# EAGLE design 453_mic (EAGLE 9.6.2)
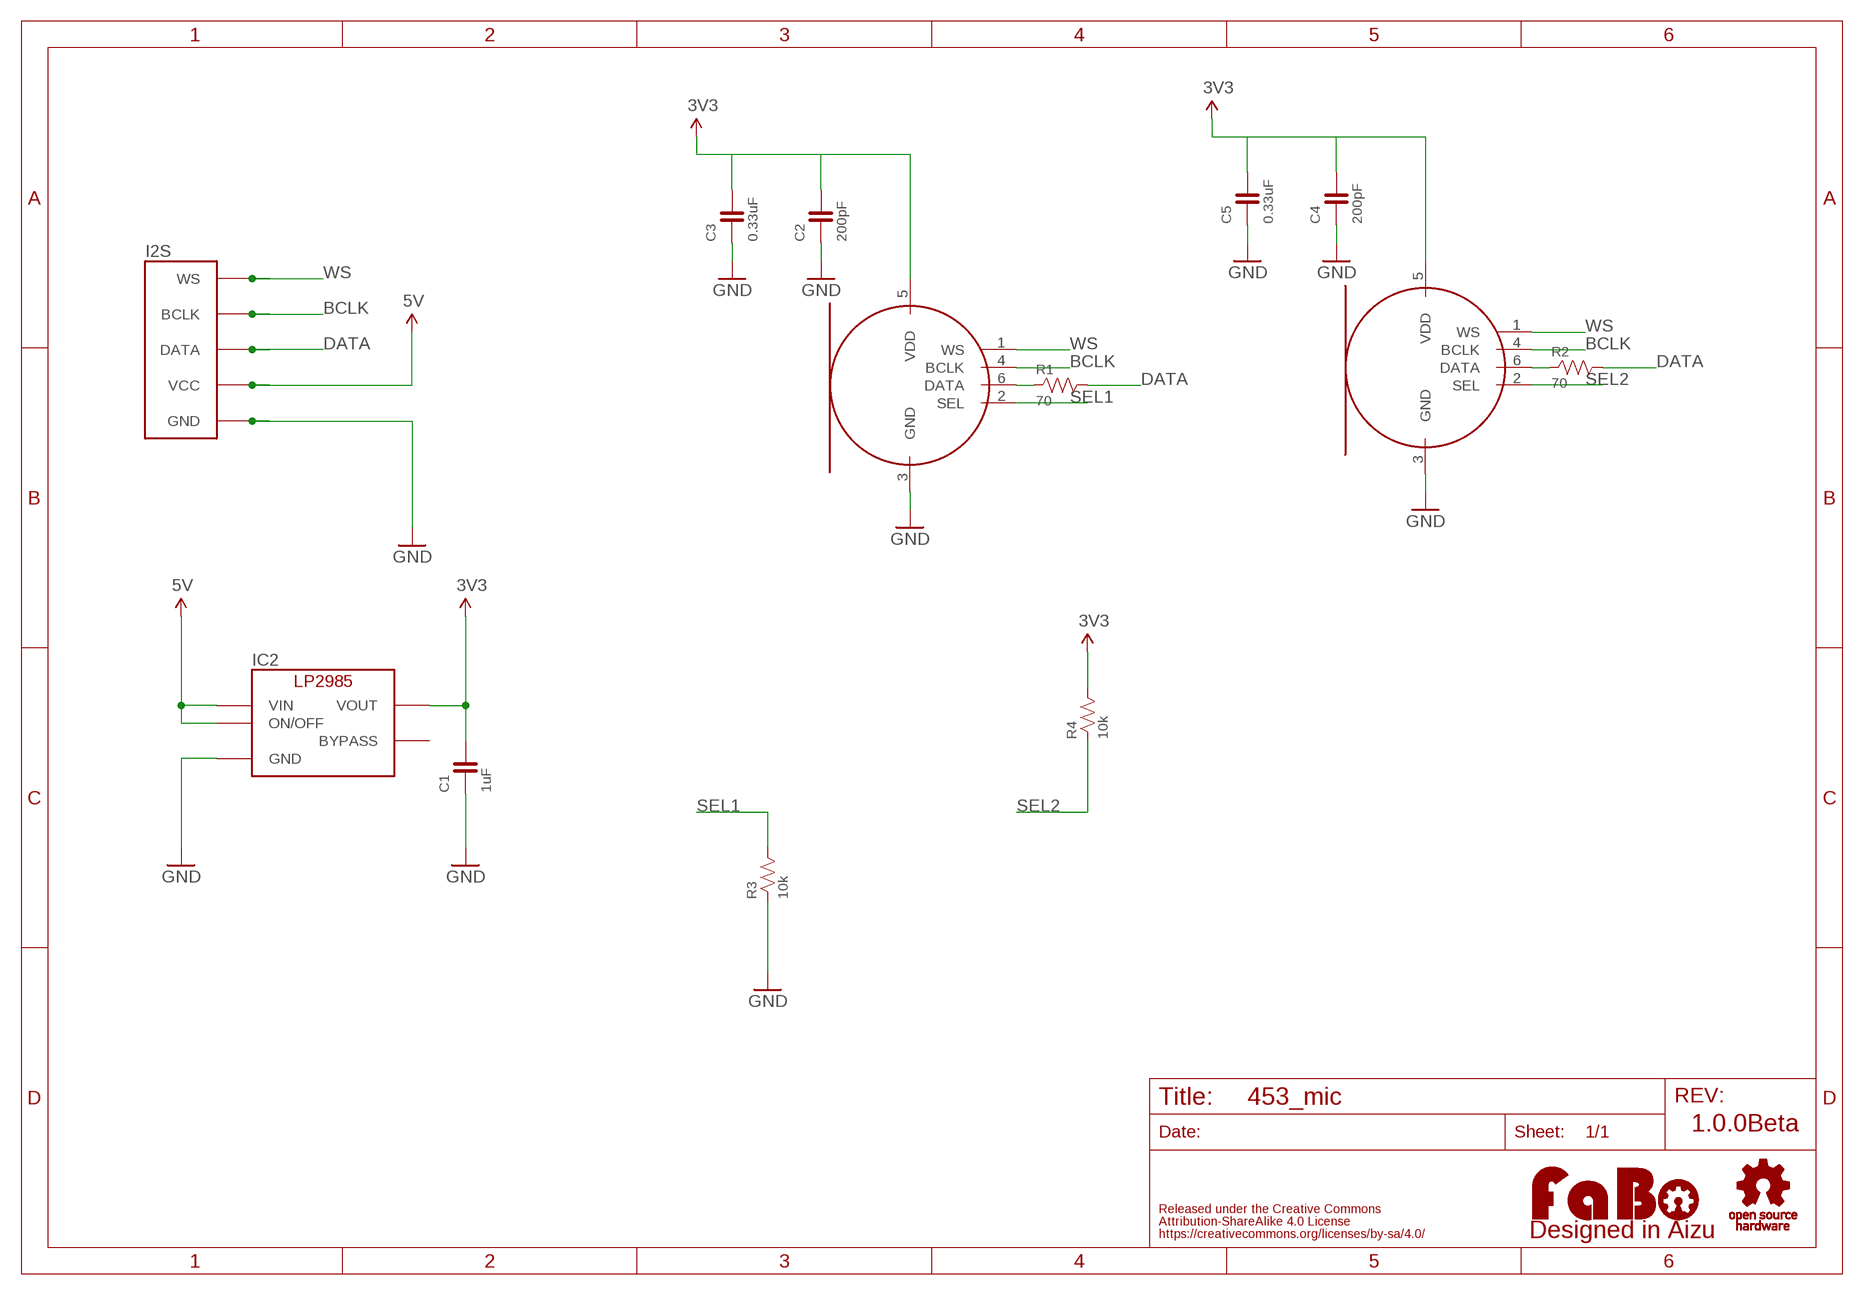
[diagram p0: schematic, sheet 1]

## Parts
C1  1uF  CAPACITOR-0603  [0603]
C2  200pF  CAPACITOR-0603  [0603]
C3  0.33uF  CAPACITOR-0603  [0603]
C4  200pF  CAPACITOR-0603  [0603]
C5  0.33uF  CAPACITOR-0603  [0603]
I2S  FABO_BRICK_I2STOP  [FABO_BRICK_I2S_B05B-PARK-1]
IC2  LP2985-33DBV  [SOT-23-5]
LOGO1  LOGO_FABO-M_BOTTOM  [LOGO_FABO_M_BOTTOM]
MIC1  KW-SPH0645  [KNOWLES-SPH0645]
MIC2  KW-SPH0645  [KNOWLES-SPH0645]
R1  70  RESISTOR-0603  [0603]
R2  70  RESISTOR-0603  [0603]
R3  10k  RESISTOR-0603  [0603]
R4  10k  RESISTOR-0603  [0603]
U$2  LOGO_OSHW-M  [LOGO_OSHW_M]

## Nets
3V3: C1.2 C2.2 C3.2 C4.2 C5.2 IC2.5(VOUT) MIC1.5(VDD) MIC2.5(VDD) R4.2
5V: I2S.VCC IC2.1(VIN) IC2.3(ON/OFF)
BCLK: I2S.BCLK MIC1.4(BCLK) MIC2.4(BCLK)
DATA: I2S.DATA R1.2 R2.2
GND: C1.1 C2.1 C3.1 C4.1 C5.1 I2S.GND IC2.2(GND) MIC1.3(GND) MIC2.3(GND) R3.1
N$1: MIC2.6(DATA) R2.1
N$6: MIC1.6(DATA) R1.1
SEL1: MIC1.2(SEL) R3.2
SEL2: MIC2.2(SEL) R4.1
WS: I2S.WS MIC1.1(WS) MIC2.1(WS)
Unconnected: IC2.4(BYPASS)

## Notes on the sheet
- 1.0.0Beta

## Library data of the parts
C1-C5 = FaBo-Capacitor:CAPACITOR: CAPACITOR
I2S = FaBo-Template:FABO_BRICK_I2S
IC2 = FaBo-Supply:LP2985: LP2985
LOGO1 = component:LOGO_FABO
MIC1 MIC2 = FaBo-Mems:KW-SPH0645
R1-R4 = FaBo-Resistors:RESISTOR: RESISTOR
U$2 = component:LOGO_OSHW

## Board
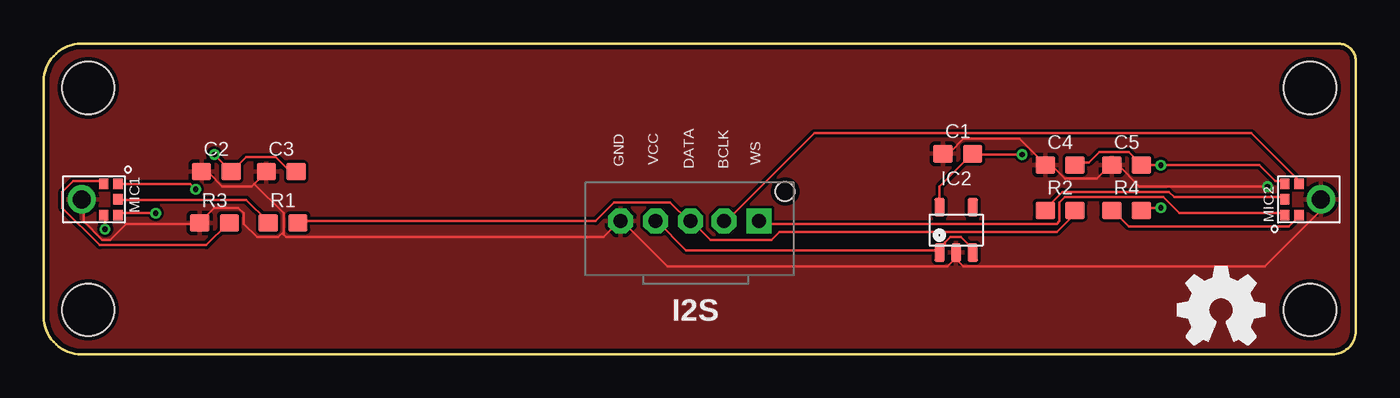
[diagram p1: board, top side]
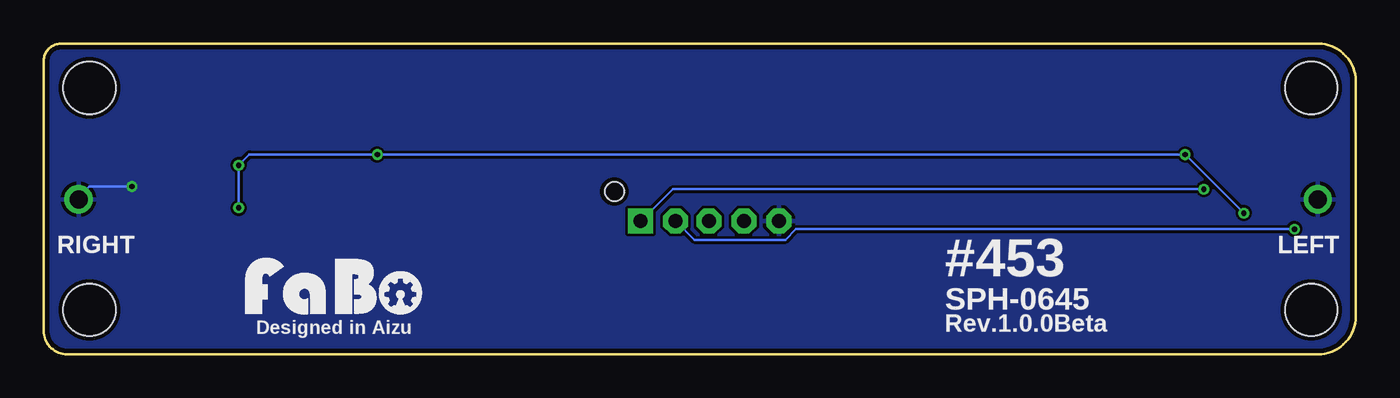
[diagram p2: board, bottom side, seen from below]

Size 75 x 17.77 mm. Coordinates in mm from the lower left corner, seen from the top.
Outline: 0,2.17 0,15.62 arc-90 2.15,17.77 74.01,17.77 arc-90 75,16.78 75,1.34 arc-90 73.66,0 2.17,0 arc-90 0,2.17
Copper layers (1*16): Top 0.035mm / dielectric 1.6mm / Bottom 0.035mm
Design rules "PCBway": minimum track width 6mil, minimum drill 12mil, track to track 6mil, track to pad 6mil, pad to pad 6mil, via to via 6mil, smd to smd 6mil, copper to edge 10mil, drill to drill 10mil, minimum pad ring 10mil, minimum via ring 6mil, stop-mask expansion 2mil, vias tented up to drill 100mil, thermal gap 8mil
Holes 3 mm at 2.54,15.24 2.54,2.54 72.39,15.24 72.39,2.54

### Footprints (pad centres in the part's own frame; a part is rotated, then mirrored left to right if it is on the bottom)
0603 = smd 1.1 x 1: 1 -0.85,0; 2 0.85,0
FABO_BRICK_I2S_B05B-PARK-1 = drill 0.8 pad 1.422 octagon: BCLK 1.635,2.54; DATA -0.27,2.54; GND -4.27,2.54; VCC -2.27,2.54 | drill 0.8 pad 1.422 square: WS 3.635,2.54 | hole 1.1: 5.135,4.24
SOT-23-5 = smd 0.6 x 1.05: 1 -0.95,-1.3; 2 0,-1.3; 3 0.95,-1.3; 4 0.95,1.3; 5 -0.95,1.3
KNOWLES-SPH0645 = smd 0.6 x 0.522: 1 -0.9,2.074; 2 -0.9,1.252; 4 0.9,1.252; 5 0.9,2.074; 6 0,2.074 | drill 1.024 pad 1.624: 3 0,0

### Placement (x,y rotation side)
C1  52.26,11.47 0 top
C2  9.87,10.46 0 top
C3  13.57,10.46 0 top
C4  58.1,10.84 0 top
C5  61.9,10.84 0 top
I2S  37.25,5.08 0 top
IC2  52.16,7.12 0 top
LOGO1  58.42,1.91 0 top
MIC1  2.17,8.87 270 top
MIC2  73.01,8.87 90 top
R1  13.68,7.51 0 top
R2  58.1,8.24 0 top
R3  9.77,7.51 0 top
R4  61.9,8.24 0 top
U$2  67.31,2.54 0 top

### Tracks (layer width: path | path; a pad name or v marks a point on that pad's centre or on a via)
3V3  (via drill 0.3)
  Top 0.152: v6.4,8.08 4.27,8.08 MIC1.5 | v9.75,11.43 10.67,10.52 C2.2 10.82,10.52 11.58,11.28 13.26,11.28 14.02,10.52 14.33,10.52 C3.2 | IC2.5 51.21,8.53 51.21,9.6 53.03,11.43 C1.2 53.19,11.43 v55.93,11.43 | MIC2.5 70.87,9.91 70.41,9.91 69.49,10.82 v63.86,10.82 62.79,10.82 C5.2 62.64,10.97 62.03,11.58 60.35,11.58 59.74,10.97 58.98,10.97 C4.2 | v63.86,8.38 62.79,8.38 R4.2
  Bottom 0.152: v6.4,8.08 v9.75,11.43 v55.93,11.43 63.25,11.43 v63.86,10.82 v63.86,8.38
5V
  Top 0.152: IC2.3 53.19,5.94 52.43,6.71 51.82,6.71 51.51,6.4 51.51,6.25 51.21,5.94 IC2.1 51.05,5.94 36.73,5.94 35.05,7.62 I2S.VCC
BCLK  (via drill 0.3)
  Top 0.152: v3.5,7.16 3.5,7.92 MIC1.4 | MIC2.4 71.63,9.91 71.63,10.06 69.04,12.65 44.04,12.65 39.01,7.62 I2S.BCLK
  Bottom 0.152: v3.5,7.16 32,7.16 32.61,6.55 37.8,6.55 38.86,7.62 I2S.BCLK
DATA
  Top 0.152: R1.2 14.63,7.62 31.55,7.62 32.61,8.69 35.81,8.69 36.88,7.62 I2S.DATA 37.03,7.62 38.1,6.55 41.6,6.55 42.06,7.01 57.91,7.01 58.83,7.92 58.83,8.23 R2.2
GND  (via drill 0.3)
  Top 0.152: 12.04,9.75 12.65,10.36 C3.1 | 12.04,9.75 11.89,9.6 10.21,9.6 9.45,10.36 9.14,10.36 C2.1 | MIC1.3 2.29,8.84 2.29,7.62 3.35,6.55 3.81,6.55 4.72,7.47 8.84,7.47 R3.1 8.99,7.62 9.75,8.38 11.12,8.38 11.43,8.08 11.43,7.47 12.19,6.71 13.41,6.71 13.72,7.01 | 12.04,9.75 13.72,8.08 13.72,7.01 | C1.1 51.51,11.58 51.82,11.58 52.58,12.34 55.78,12.34 57.15,10.97 C4.1 57.3,10.82 57.61,10.82 58.37,10.06 60.2,10.06 60.96,10.82 C5.1 61.11,10.82 61.42,10.82 62.64,9.6 v69.95,9.6 | 52.12,5.49 52.12,5.79 IC2.2 52.12,5.49 | 52.12,5.49 51.66,5.03 35.66,5.03 33.07,7.62 I2S.GND 32.92,7.62 32,6.71 13.87,6.71 13.72,6.86 13.72,7.01 | 52.12,5.49 52.58,5.03 69.8,5.03 73,8.23 73,8.84 MIC2.3
  Bottom 0.152: v69.95,9.6 72.39,9.6 73,8.99 MIC2.3
  pour Top: 0,0 0,17.78 74.93,17.78 74.93,0
  pour Bottom: 0,0 0,17.78 74.93,17.78 74.93,0
N$1
  Top 0.152: MIC2.6 70.87,8.99 64.62,8.99 64.31,9.3 58.22,9.3 57.3,8.38 R2.1
N$6
  Top 0.152: MIC1.6 4.27,8.84 11.58,8.84 12.8,7.62 R1.1
SEL1
  Top 0.152: MIC1.2 3.35,9.91 1.68,9.91 1.07,9.3 1.07,8.38 3.2,6.25 9.3,6.25 10.52,7.47 R3.2
SEL2
  Top 0.152: MIC2.2 71.63,7.92 71.63,7.77 71.17,7.32 62.03,7.32 61.11,8.23 R4.1
WS  (via drill 0.3)
  Top 0.152: v8.69,9.45 8.38,9.75 4.27,9.75 MIC1.1 | MIC2.1 70.87,8.08 64.92,8.08 64.01,8.99 58.37,8.99 58.06,8.69 58.06,7.62 57.91,7.47 41.15,7.47 41,7.62 I2S.WS
  Bottom 0.152: v8.69,9.45 39.01,9.45 40.84,7.62 I2S.WS

### Text on the board
tPlace: GND | VCC | DATA | BCLK | WS
bPlace: LEFT | RIGHT | #453 | SPH-0645 | Designed in Aizu | Rev.1.0.0Beta